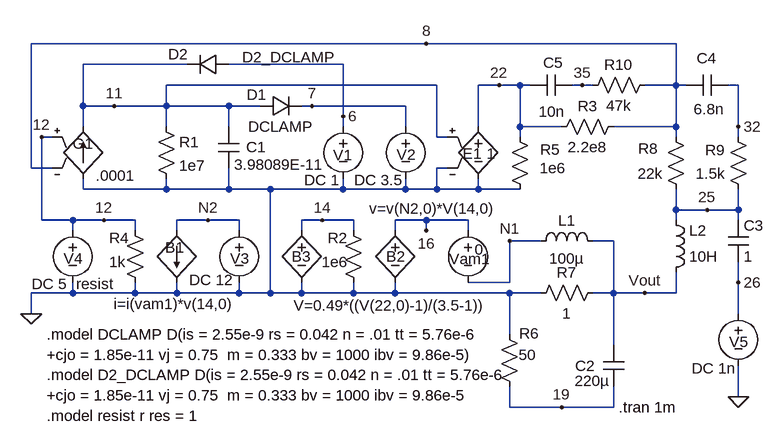
[diagram p0: schematic Sg1524.asc]
Sg1524.asc, the LTspice schematic file:
Version 4
SHEET 1 988 732
WIRE -144 224 -144 32
WIRE -144 448 -144 416
WIRE -128 304 -128 176
WIRE -112 176 -128 176
WIRE -112 224 -144 224
WIRE -80 304 -128 304
WIRE -80 320 -80 304
WIRE -80 416 -144 416
WIRE -80 416 -80 400
WIRE -64 128 -64 64
WIRE -64 160 -64 128
WIRE -64 256 -64 240
WIRE -32 304 -80 304
WIRE -16 128 -64 128
WIRE 16 304 -32 304
WIRE 16 320 16 304
WIRE 16 416 -80 416
WIRE 16 416 16 400
WIRE 64 128 -16 128
WIRE 64 128 64 96
WIRE 64 160 64 128
WIRE 64 256 -64 256
WIRE 64 256 64 240
WIRE 80 320 80 304
WIRE 80 416 16 416
WIRE 80 416 80 400
WIRE 96 64 -64 64
WIRE 128 304 80 304
WIRE 160 128 64 128
WIRE 160 160 160 128
WIRE 160 256 64 256
WIRE 160 256 160 224
WIRE 176 304 128 304
WIRE 176 320 176 304
WIRE 176 416 80 416
WIRE 176 416 176 400
WIRE 208 128 160 128
WIRE 224 256 160 256
WIRE 224 416 176 416
WIRE 224 416 224 256
WIRE 272 320 272 304
WIRE 272 416 224 416
WIRE 272 416 272 400
WIRE 288 128 272 128
WIRE 304 304 272 304
WIRE 336 64 160 64
WIRE 336 144 336 64
WIRE 336 160 336 144
WIRE 336 256 224 256
WIRE 336 256 336 240
WIRE 352 304 304 304
WIRE 352 320 352 304
WIRE 352 416 272 416
WIRE 352 416 352 400
WIRE 416 320 416 304
WIRE 416 416 352 416
WIRE 416 416 416 400
WIRE 432 128 288 128
WIRE 432 160 432 128
WIRE 432 256 336 256
WIRE 432 256 432 240
WIRE 464 32 -144 32
WIRE 464 304 416 304
WIRE 464 320 464 304
WIRE 480 96 64 96
WIRE 480 176 480 96
WIRE 480 256 432 256
WIRE 480 256 480 224
WIRE 496 176 480 176
WIRE 496 224 480 224
WIRE 528 304 464 304
WIRE 528 320 528 304
WIRE 544 160 544 96
WIRE 544 256 480 256
WIRE 544 256 544 240
WIRE 576 96 544 96
WIRE 592 400 528 400
WIRE 592 400 592 336
WIRE 592 416 416 416
WIRE 592 480 592 416
WIRE 592 592 592 560
WIRE 608 96 576 96
WIRE 608 160 608 96
WIRE 608 176 608 160
WIRE 608 256 544 256
WIRE 624 96 608 96
WIRE 640 336 592 336
WIRE 640 416 592 416
WIRE 672 160 608 160
WIRE 672 592 592 592
WIRE 704 96 688 96
WIRE 720 96 704 96
WIRE 752 336 720 336
WIRE 752 416 720 416
WIRE 752 416 752 336
WIRE 752 496 752 416
WIRE 752 592 672 592
WIRE 752 592 752 560
WIRE 800 416 752 416
WIRE 848 32 464 32
WIRE 848 96 800 96
WIRE 848 96 848 32
WIRE 848 160 752 160
WIRE 848 160 848 96
WIRE 848 176 848 160
WIRE 848 288 848 256
WIRE 848 304 848 288
WIRE 848 416 800 416
WIRE 848 416 848 384
WIRE 864 96 848 96
WIRE 896 288 848 288
WIRE 944 96 928 96
WIRE 944 160 944 96
WIRE 944 176 944 160
WIRE 944 288 896 288
WIRE 944 288 944 256
WIRE 944 304 944 288
WIRE 944 400 944 368
WIRE 944 448 944 400
WIRE 944 576 944 528
FLAG -144 448 0
FLAG -16 128 11
FLAG -128 176 12
FLAG 336 144 6
FLAG 288 128 7
FLAG 128 304 N2
FLAG -32 304 12
FLAG 304 304 14
FLAG 464 320 16
FLAG 592 336 N1
FLAG 576 96 22
FLAG 800 416 Vout
FLAG 672 592 19
FLAG 896 288 25
FLAG 944 400 26
FLAG 944 576 0
FLAG 464 32 8
FLAG 944 160 32
FLAG 704 96 35
SYMBOL g -64 144 R0
WINDOW 0 -16 42 Left 0
WINDOW 3 19 91 Left 0
SYMATTR InstName G1
SYMATTR Value .0001
SYMBOL res 48 144 R0
SYMATTR InstName R1
SYMATTR Value 1e7
SYMBOL cap 144 160 R0
WINDOW 0 43 31 Left 0
WINDOW 3 24 58 Left 0
SYMATTR InstName C1
SYMATTR Value 3.98089E-11
SYMBOL voltage 336 144 R0
WINDOW 0 -15 60 Left 0
WINDOW 3 -60 98 Left 0
SYMATTR InstName V1
SYMATTR Value DC 1
SYMBOL diode 208 112 M90
WINDOW 0 14 -5 VBottom 0
WINDOW 3 32 32 VTop 0
SYMATTR InstName D1
SYMATTR Value DCLAMP
SYMBOL voltage 432 144 R0
WINDOW 0 -14 59 Left 0
WINDOW 3 -79 98 Left 0
SYMATTR InstName V2
SYMATTR Value DC 3.5
SYMBOL voltage 176 304 R0
WINDOW 0 -14 59 Left 0
WINDOW 3 -77 92 Left 0
SYMATTR InstName V3
SYMATTR Value DC 12
SYMBOL diode 160 48 R90
WINDOW 0 16 78 VBottom 0
WINDOW 3 -11 -93 VTop 0
SYMATTR InstName D2
SYMATTR Value D2_DCLAMP
SYMBOL voltage -80 304 R0
WINDOW 0 -14 59 Left 0
WINDOW 3 -63 98 Left 0
SYMATTR InstName V4
SYMATTR Value DC 5
SYMBOL res 336 304 R0
WINDOW 0 -24 27 Left 0
WINDOW 3 -33 64 Left 0
SYMATTR InstName R2
SYMATTR Value 1e6
SYMBOL res 0 304 R0
WINDOW 0 -24 27 Left 0
WINDOW 3 -24 64 Left 0
WINDOW 38 -75 98 Left 0
SYMATTR InstName R4
SYMATTR Value 1k
SYMATTR SpiceModel resist
SYMBOL voltage 528 304 R0
WINDOW 0 -29 60 Left 0
WINDOW 3 10 45 Left 0
SYMATTR InstName Vam1
SYMATTR Value 0
SYMBOL bi 80 320 R0
WINDOW 0 -18 26 Left 0
WINDOW 3 -97 113 Left 0
SYMATTR InstName B1
SYMATTR Value i=i(vam1)*v(14,0)
SYMBOL bv 416 304 R0
WINDOW 0 -14 56 Left 0
WINDOW 3 -40 -18 Left 0
SYMATTR InstName B2
SYMATTR Value v=v(N2,0)*V(14,0)
SYMBOL res 592 160 R0
WINDOW 0 47 35 Left 0
WINDOW 3 46 64 Left 0
SYMATTR InstName R5
SYMATTR Value 1e6
SYMBOL bv 272 304 R0
WINDOW 0 -15 56 Left 0
WINDOW 3 -12 131 Left 0
SYMATTR InstName B3
SYMATTR Value V=0.49*((V(22,0)-1)/(3.5-1))
SYMBOL ind 624 352 R270
WINDOW 0 32 56 VTop 0
WINDOW 3 5 56 VBottom 0
SYMATTR InstName L1
SYMATTR Value 100µ
SYMBOL cap 736 496 R0
WINDOW 0 -43 32 Left 0
WINDOW 3 -44 55 Left 0
SYMATTR InstName C2
SYMATTR Value 220µ
SYMBOL res 576 464 R0
WINDOW 0 31 14 Left 0
WINDOW 3 30 47 Left 0
SYMATTR InstName R6
SYMATTR Value 50
SYMBOL res 736 400 R90
WINDOW 0 0 56 VBottom 0
WINDOW 3 32 56 VTop 0
SYMATTR InstName R7
SYMATTR Value 1
SYMBOL ind 832 400 M180
WINDOW 0 36 80 Left 0
WINDOW 3 36 40 Left 0
SYMATTR InstName L2
SYMATTR Value 10H
SYMBOL cap 928 304 R0
SYMATTR InstName C3
SYMATTR Value 1
SYMBOL voltage 944 432 R0
WINDOW 0 -14 59 Left 0
WINDOW 3 -72 100 Left 0
SYMATTR InstName V5
SYMATTR Value DC 1n
SYMBOL res 864 272 R180
WINDOW 0 43 78 Left 0
WINDOW 3 36 40 Left 0
SYMATTR InstName R8
SYMATTR Value 22k
SYMBOL res 960 272 R180
WINDOW 0 36 76 Left 0
WINDOW 3 36 40 Left 0
SYMATTR InstName R9
SYMATTR Value 1.5k
SYMBOL cap 928 80 R90
WINDOW 0 -10 33 VBottom 0
WINDOW 3 37 29 VTop 0
SYMATTR InstName C4
SYMATTR Value 6.8n
SYMBOL res 816 80 R90
WINDOW 0 0 56 VBottom 0
WINDOW 3 32 56 VTop 0
SYMATTR InstName R10
SYMATTR Value 47k
SYMBOL e 544 144 R0
WINDOW 0 -24 57 Left 0
WINDOW 3 13 57 Left 0
SYMATTR InstName E1
SYMATTR Value 1
SYMBOL res 768 144 R90
WINDOW 0 0 56 VBottom 0
WINDOW 3 32 56 VTop 0
SYMATTR InstName R3
SYMATTR Value 2.2e8
SYMBOL cap 688 80 R90
WINDOW 0 -3 29 VBottom 0
WINDOW 3 41 31 VTop 0
SYMATTR InstName C5
SYMATTR Value 10n
TEXT -120 480 Left 0 !.model DCLAMP D(is = 2.55e-9 rs = 0.042 n = .01 tt = 5.76e-6\n+cjo = 1.85e-11 vj = 0.75  m = 0.333 bv = 1000 ibv = 9.86e-5) \n.model D2_DCLAMP D(is = 2.55e-9 rs = 0.042 n = .01 tt = 5.76e-6\n+cjo = 1.85e-11 vj = 0.75  m = 0.333 bv = 1000 ibv = 9.86e-5\n.model resist r res = 1
TEXT 760 592 Left 0 !.tran 1m

The netlist it stands for:
* Sg1524.asc
G1 0 11 12 8 .0001
R1 11 0 1e7
C1 11 0 3.98089E-11
V1 6 0 DC 1
D1 11 7 DCLAMP
V2 7 0 DC 3.5
V3 N2 0 DC 12
D2 6 11 D2_DCLAMP
V4 12 0 DC 5
R2 14 0 1e6
R4 12 0 resist 1k
Vam1 16 N1 0
B1 N2 0 i=i(vam1)*v(14,0)
B2 16 0 v=v(N2,0)*V(14,0)
R5 22 0 1e6
B3 14 0 V=0.49*((V(22,0)-1)/(3.5-1))
L1 N1 Vout 100µ
C2 Vout 19 220µ
R6 0 19 50
R7 Vout 0 1
L2 Vout 25 10H
C3 25 26 1
V5 26 0 DC 1n
R8 25 8 22k
R9 25 32 1.5k
C4 32 8 6.8n
R10 8 35 47k
E1 22 0 11 0 1
R3 8 22 2.2e8
C5 35 22 10n
.model D D
.lib standard.dio
.model DCLAMP D(is = 2.55e-9 rs = 0.042 n = .01 tt = 5.76e-6
+cjo = 1.85e-11 vj = 0.75  m = 0.333 bv = 1000 ibv = 9.86e-5)
.model D2_DCLAMP D(is = 2.55e-9 rs = 0.042 n = .01 tt = 5.76e-6
+cjo = 1.85e-11 vj = 0.75  m = 0.333 bv = 1000 ibv = 9.86e-5
.model resist r res = 1
.tran 1m
.backanno
.end